# EAGLE schematic picoclick_c3t (EAGLE 9.6.2)
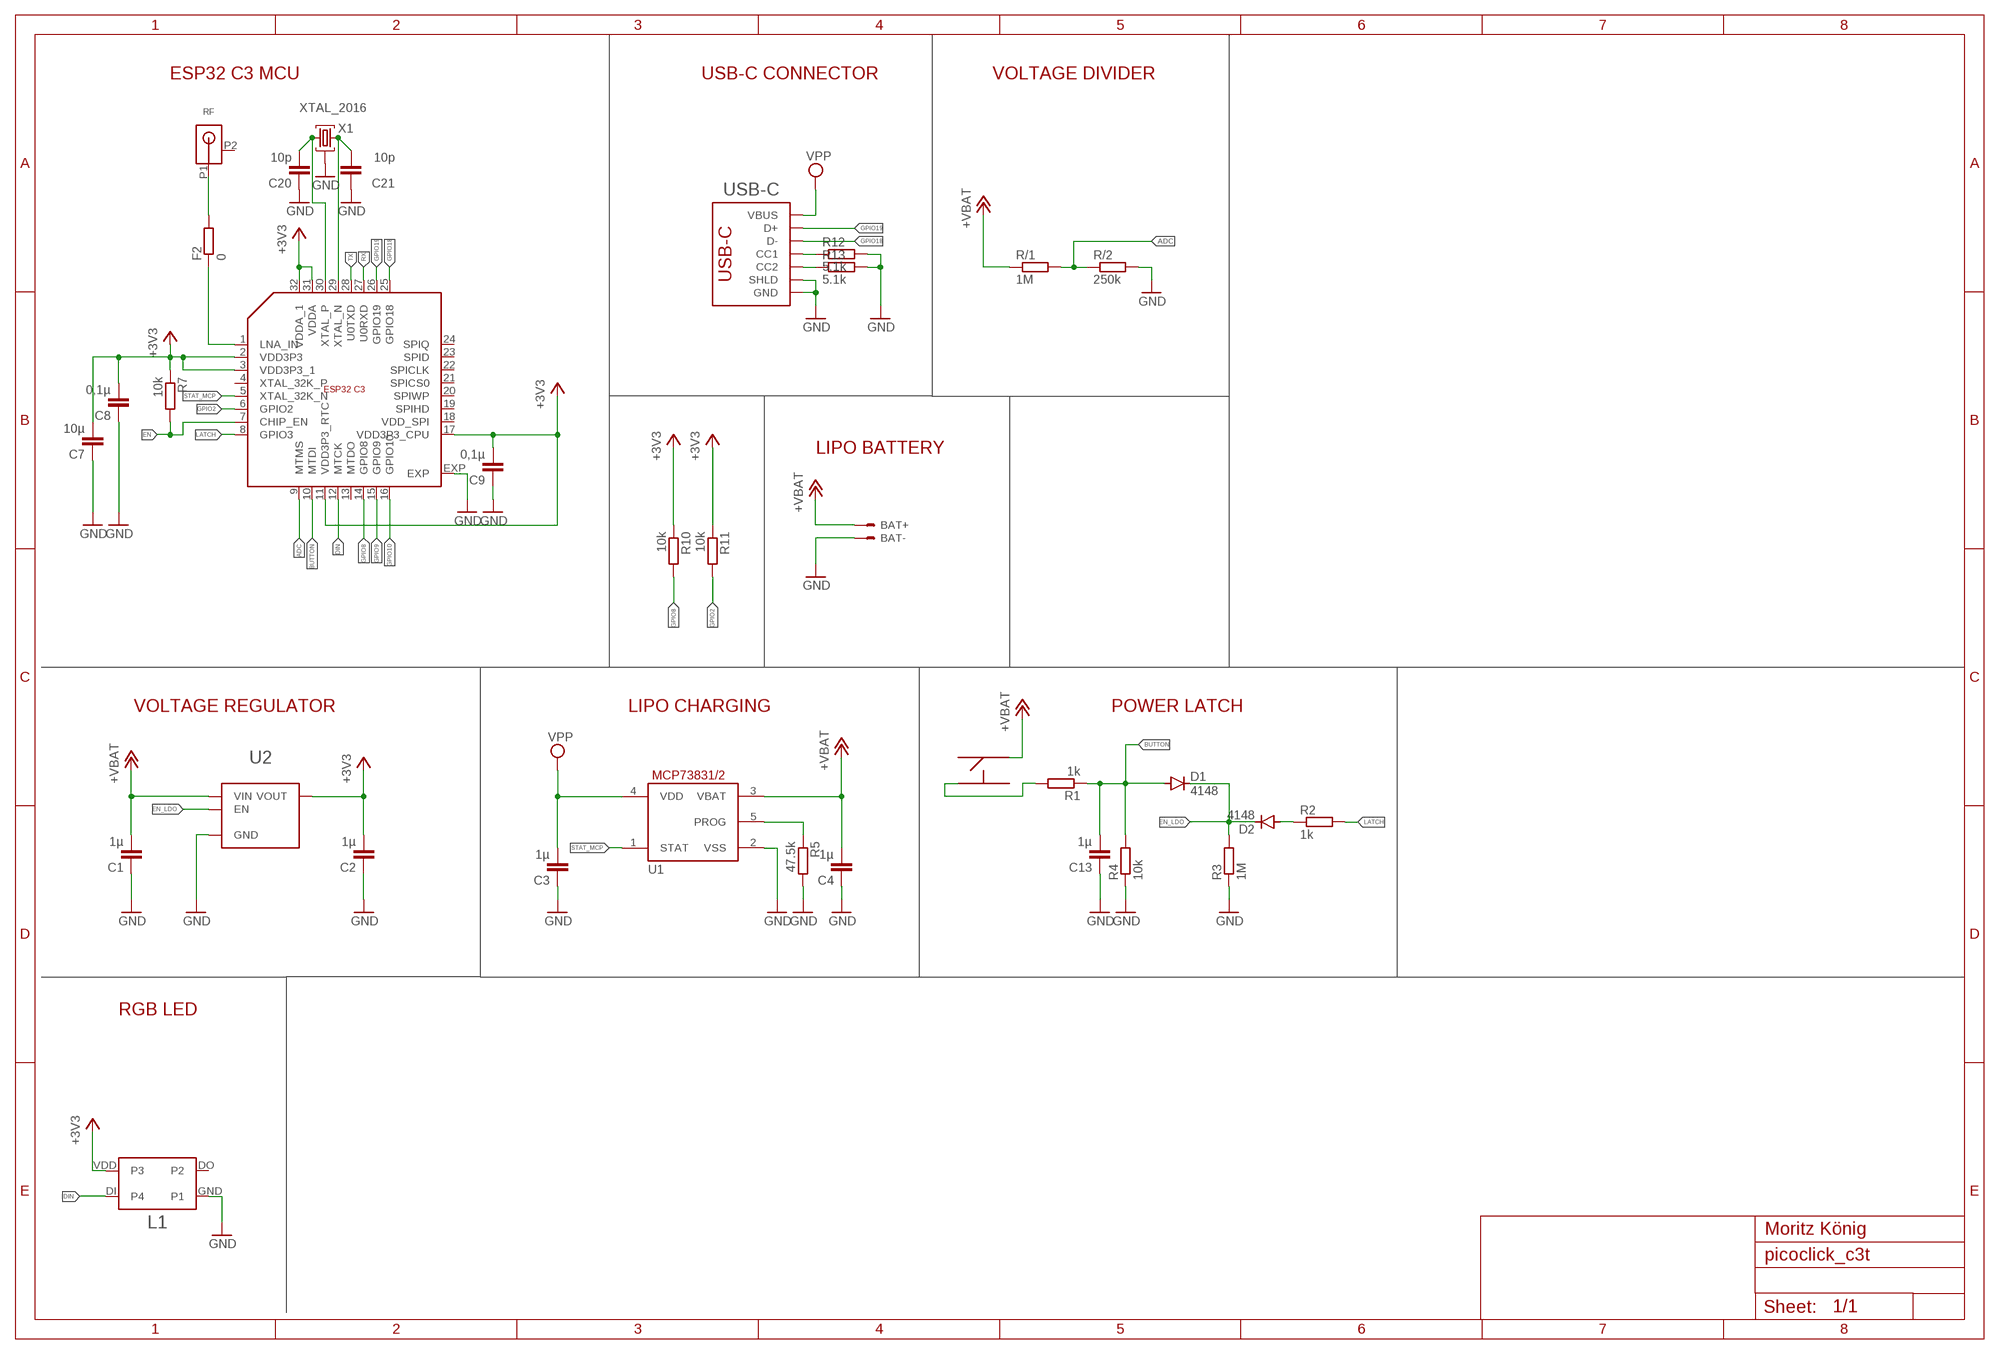
[diagram p0: schematic, sheet 1]

## Parts
BAT+  TP/SP-1.5X1.0  [SOLDERPAD_1.5X1.0]
BAT-  TP/SP-1.5X1.0  [SOLDERPAD_1.5X1.0]
C1  1µ  C-EU-0402-WOKEEPOUT_S  [C0402_S]
C2  1µ  C-EU-0402-WOKEEPOUT_S  [C0402_S]
C3  1µ  C-EU-0402-WOKEEPOUT_S  [C0402_S]
C4  1µ  C-EU-0402-WOKEEPOUT_S  [C0402_S]
C7  10µ  C-EU-0402-WOKEEPOUT_S  [C0402_S]
C8  0,1µ  C-EU-0402-WOKEEPOUT_S  [C0402_S]
C9  0,1µ  C-EU-0402-WOKEEPOUT_S  [C0402_S]
C13  1µ  C-EU-0402-WOKEEPOUT_S  [C0402_S]
C20  10p  C-EU-0402-WOKEEPOUT_S  [C0402_S]
C21  10p  C-EU-0402-WOKEEPOUT_S  [C0402_S]
D1  4148  DIODE-SOD523  [SOD523]
D2  4148  DIODE-SOD523  [SOD523]
ESP1  ESP32_C3_QFN32  [QFN32]
F2  0  R-EU-0402-WOKEEPOUT  [R0402]
L1  WS2812_2020  [WS2812_2020]
R1  1k  R-EU-0402-WOKEEPOUT  [R0402]
R2  1k  R-EU-0402-WOKEEPOUT  [R0402]
R3  1M  R-EU-0402-WOKEEPOUT  [R0402]
R4  10k  R-EU-0402-WOKEEPOUT  [R0402]
R5  47.5k  R-EU-0402-WOKEEPOUT  [R0402]
R7  10k  R-EU-0402-WOKEEPOUT  [R0402]
R10  10k  R-EU-0402-WOKEEPOUT  [R0402]
R11  10k  R-EU-0402-WOKEEPOUT  [R0402]
R12  5.1k  R-EU-0402-WOKEEPOUT  [R0402]
R13  5.1k  R-EU-0402-WOKEEPOUT  [R0402]
R/1  1M  R-EU-0402-WOKEEPOUT  [R0402]
R/2  250k  R-EU-0402-WOKEEPOUT  [R0402]
RF  ANT3216LL00R2400A  [ANT3216LL00R2400A]
U1  BRCL4054BME  MCP73831_SOT23_5  [SOT23-5]
U2  MIC5504  [TDFN4]
U$1  BUTTON_ST-1187-3  [BUTTON_ST-1187-3]
USB-C  USB_C_C393939  [USBC_C393939]
X1  XTAL_2016  [XTYL_2016]

## Nets
+3V3: C2.P$2 C7.P$2 C8.P$2 C9.P$2 ESP1.2(VDD3P3) ESP1.3(VDD3P3_1) ESP1.11(VDD3P3_RTC) ESP1.17(VDD3P3_CPU) ESP1.31(VDDA) ESP1.32(VDDA_1) L1.VDD(P3) R7.1 R10.1 R11.1 U2.P1(VOUT)
+VBAT: BAT+.1(S) C1.P$2 C4.P$2 R/1.1 U1.3(VBAT) U2.P4(VIN) U$1.P2
ADC: ESP1.9(MTMS) R/1.2 R/2.1
BUTTON: C13.P$2 D1.A ESP1.10(MTDI) R1.1 R4.2
DIN: ESP1.12(MTCK) L1.DI(P4)
EN: ESP1.7(CHIP_EN) R7.2
EN_LDO: D1.C D2.C R3.2 U2.P3(EN)
GND: BAT-.1(S) C1.P$1 C2.P$1 C3.P$1 C4.P$1 C7.P$1 C8.P$1 C9.P$1 C13.P$1 C20.P$1 C21.P$1 ESP1.EXP L1.GND(P1) R3.1 R4.1 R5.2 R12.2 R13.2 R/2.2 U1.2(VSS) U2.EXP(GND) U2.P2(GND) USB-C.A1B12(GND) USB-C.B1A12(GND) USB-C.S1(SHLD) USB-C.S2(SHLD) USB-C.S3(SHLD) USB-C.S4(SHLD) X1.P2(G) X1.P4(G)
GPIO2: ESP1.6(GPIO2) R11.2
GPIO8: ESP1.14(GPIO8) R10.2
GPIO9: ESP1.15(GPIO9)
GPIO10: ESP1.16(GPIO10)
GPIO18: ESP1.25(GPIO18) USB-C.A7(D-) USB-C.B7(D-)
GPIO19: ESP1.26(GPIO19) USB-C.A6(D+) USB-C.B6(D+)
LATCH: ESP1.8(GPIO3) R2.2
N$1: R1.2 U$1.P3
N$4: ESP1.1(LNA_IN) F2.1
N$6: F2.2 RF.P1(ANT)
N$16: D2.A R2.1
N$18: R13.1 USB-C.B5(CC2)
N$23: R5.1 U1.5(PROG)
N$25: R12.1 USB-C.A5(CC1)
N$26: C20.P$2 ESP1.30(XTAL_P) X1.P1
N$27: C21.P$2 ESP1.29(XTAL_N) X1.P3
RX: ESP1.27(U0RXD)
STAT_MCP: ESP1.5(XTAL_32K_N) U1.1(STAT)
TX: ESP1.28(U0TXD)
VPP: C3.P$2 U1.4(VDD) USB-C.A4B9(VBUS) USB-C.B4A9(VBUS)
Unconnected: ESP1.4(XTAL_32K_P) ESP1.13(MTDO) ESP1.18(VDD_SPI) ESP1.19(SPIHD) ESP1.20(SPIWP) ESP1.21(SPICS0) ESP1.22(SPICLK) ESP1.23(SPID) ESP1.24(SPIQ) L1.DO(P2) RF.P2(GND) U$1.P1 U$1.P4

## Notes on the sheet
- ESP32 C3 MCU | USB-C CONNECTOR | VOLTAGE DIVIDER
- LIPO BATTERY
- VOLTAGE REGULATOR | LIPO CHARGING | POWER LATCH
- RGB LED
- Moritz König

## Library data of the parts
BAT+ BAT- = iml_elc:TP/SP: Solderpads/Testpads
C1-C4 C7-C9 C13 C20 C21 = moekoe:C-EU-0402-WOKEEPOUT
D1 D2 = diode:DIODE-: DIODE
ESP1 = moekoe:ESP32_C3_QFN32
F2 R1-R5 R7 R10-R13 R/1 R/2 = moekoe:R-EU-0402-WOKEEPOUT
L1 = moekoe:WS2812_2020
RF = moekoe:ANT3216LL00R2400A
U1 = moekoe:MCP73831
U2 = moekoe:MIC5504
U$1 = moekoe:BUTTON_ST-1187-3
USB-C = moekoe:USB_C_C393939
X1 = moekoe:XTAL_2016